# EAGLE schematic LED-plus-SHIM (EAGLE 9.6.2)

## Sheet 1 of 4
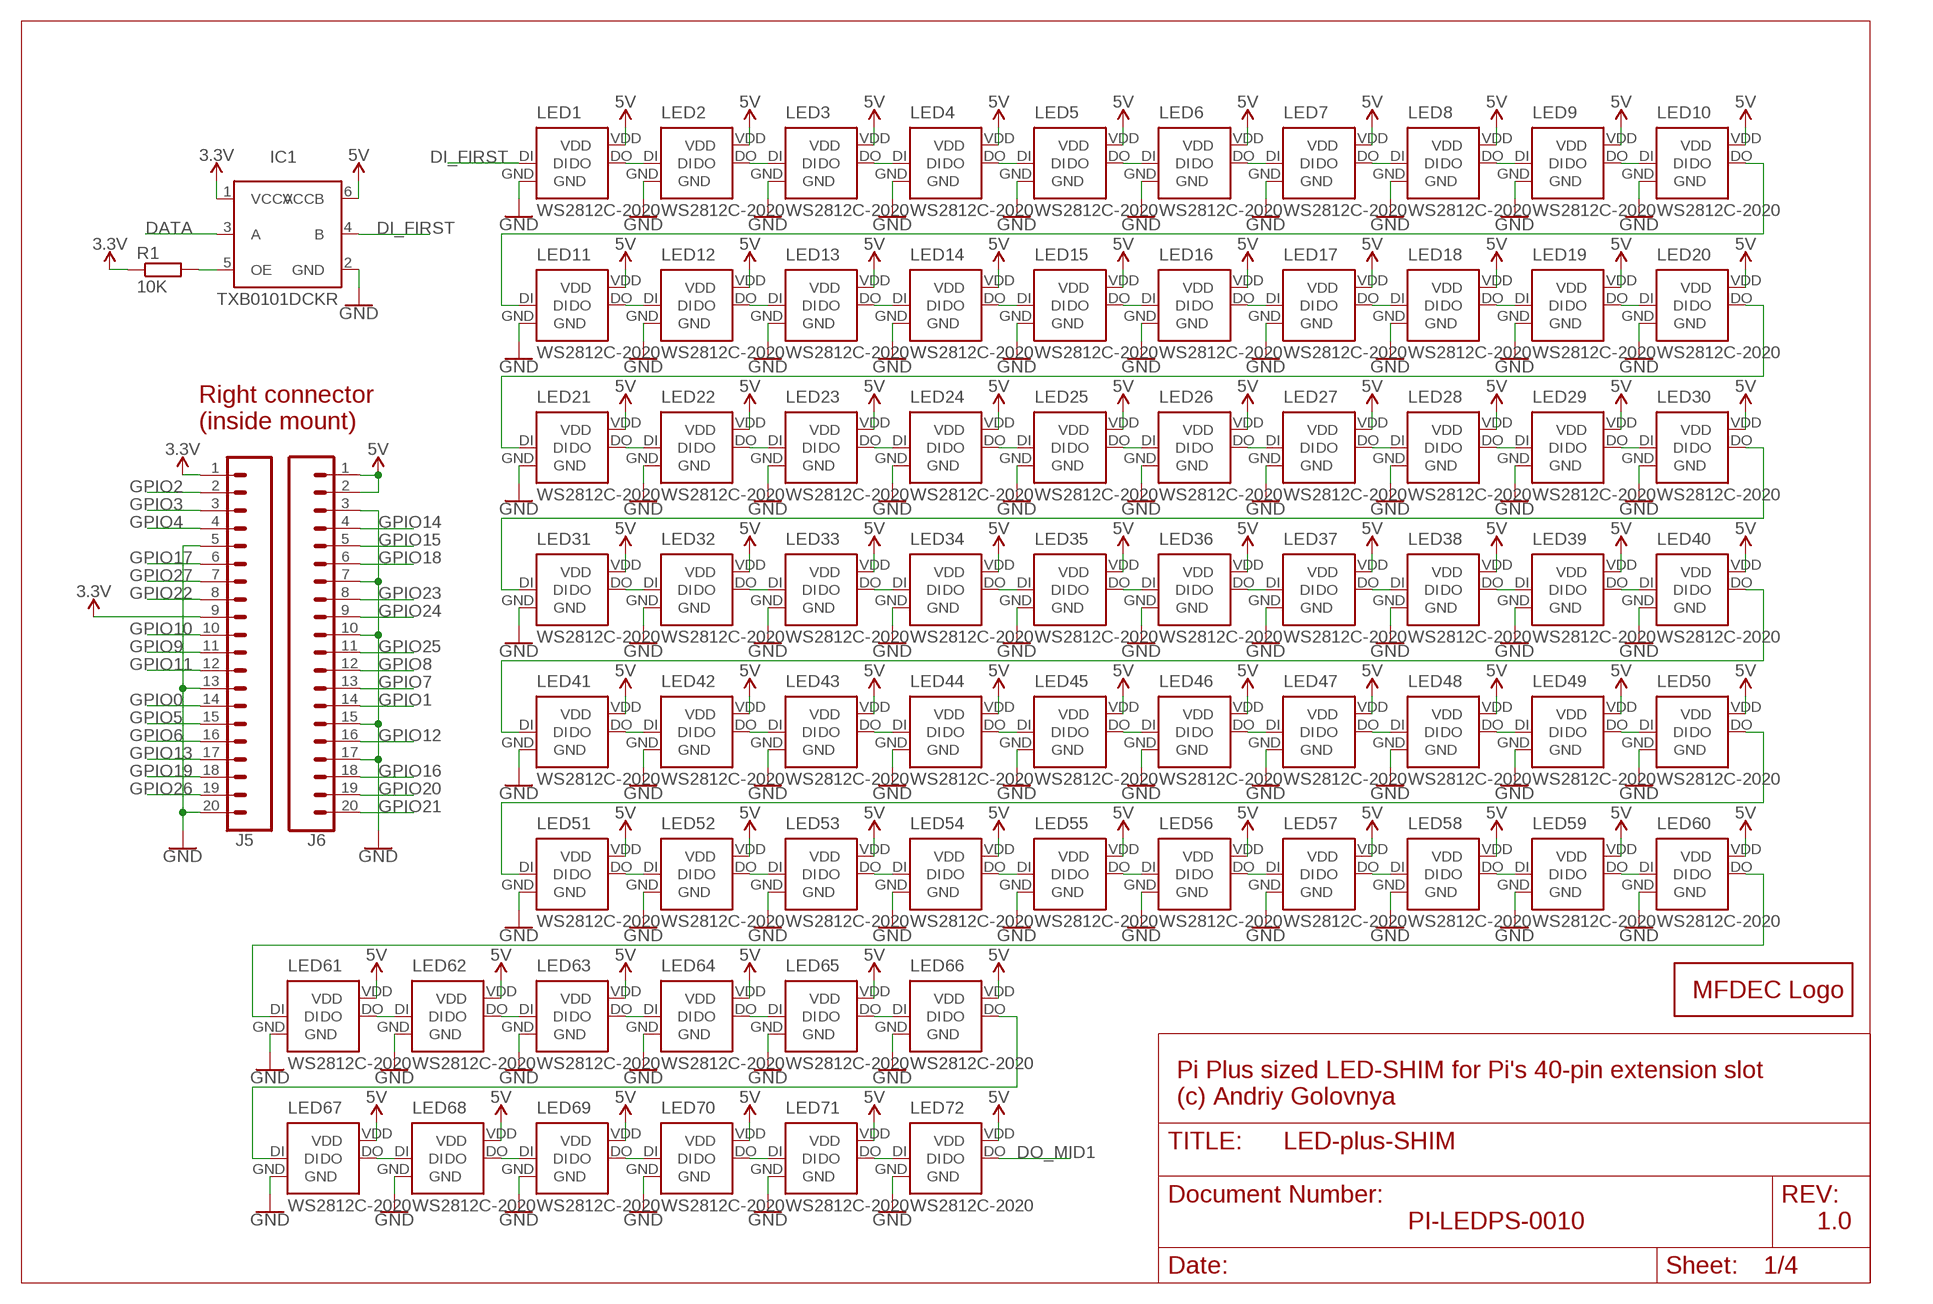
[diagram p0: schematic, sheet 1]

### Parts
IC1  TXB0101DCKR  [SOT65P210X110-6N]
J5  CONN_20LOCK  [1X20_LOCK]
J6  CONN_20LOCK  [1X20_LOCK]
LED1  WS2812C-2020  [WS2812X-2020]
LED2  WS2812C-2020  [WS2812X-2020]
LED3  WS2812C-2020  [WS2812X-2020]
LED4  WS2812C-2020  [WS2812X-2020]
LED5  WS2812C-2020  [WS2812X-2020]
LED6  WS2812C-2020  [WS2812X-2020]
LED7  WS2812C-2020  [WS2812X-2020]
LED8  WS2812C-2020  [WS2812X-2020]
LED9  WS2812C-2020  [WS2812X-2020]
LED10  WS2812C-2020  [WS2812X-2020]
LED11  WS2812C-2020  [WS2812X-2020]
LED12  WS2812C-2020  [WS2812X-2020]
LED13  WS2812C-2020  [WS2812X-2020]
LED14  WS2812C-2020  [WS2812X-2020]
LED15  WS2812C-2020  [WS2812X-2020]
LED16  WS2812C-2020  [WS2812X-2020]
LED17  WS2812C-2020  [WS2812X-2020]
LED18  WS2812C-2020  [WS2812X-2020]
LED19  WS2812C-2020  [WS2812X-2020]
LED20  WS2812C-2020  [WS2812X-2020]
LED21  WS2812C-2020  [WS2812X-2020]
LED22  WS2812C-2020  [WS2812X-2020]
LED23  WS2812C-2020  [WS2812X-2020]
LED24  WS2812C-2020  [WS2812X-2020]
LED25  WS2812C-2020  [WS2812X-2020]
LED26  WS2812C-2020  [WS2812X-2020]
LED27  WS2812C-2020  [WS2812X-2020]
LED28  WS2812C-2020  [WS2812X-2020]
LED29  WS2812C-2020  [WS2812X-2020]
LED30  WS2812C-2020  [WS2812X-2020]
LED31  WS2812C-2020  [WS2812X-2020]
LED32  WS2812C-2020  [WS2812X-2020]
LED33  WS2812C-2020  [WS2812X-2020]
LED34  WS2812C-2020  [WS2812X-2020]
LED35  WS2812C-2020  [WS2812X-2020]
LED36  WS2812C-2020  [WS2812X-2020]
LED37  WS2812C-2020  [WS2812X-2020]
LED38  WS2812C-2020  [WS2812X-2020]
LED39  WS2812C-2020  [WS2812X-2020]
LED40  WS2812C-2020  [WS2812X-2020]
LED41  WS2812C-2020  [WS2812X-2020]
LED42  WS2812C-2020  [WS2812X-2020]
LED43  WS2812C-2020  [WS2812X-2020]
LED44  WS2812C-2020  [WS2812X-2020]
LED45  WS2812C-2020  [WS2812X-2020]
LED46  WS2812C-2020  [WS2812X-2020]
LED47  WS2812C-2020  [WS2812X-2020]
LED48  WS2812C-2020  [WS2812X-2020]
LED49  WS2812C-2020  [WS2812X-2020]
LED50  WS2812C-2020  [WS2812X-2020]
LED51  WS2812C-2020  [WS2812X-2020]
LED52  WS2812C-2020  [WS2812X-2020]
LED53  WS2812C-2020  [WS2812X-2020]
LED54  WS2812C-2020  [WS2812X-2020]
LED55  WS2812C-2020  [WS2812X-2020]
LED56  WS2812C-2020  [WS2812X-2020]
LED57  WS2812C-2020  [WS2812X-2020]
LED58  WS2812C-2020  [WS2812X-2020]
LED59  WS2812C-2020  [WS2812X-2020]
LED60  WS2812C-2020  [WS2812X-2020]
LED61  WS2812C-2020  [WS2812X-2020]
LED62  WS2812C-2020  [WS2812X-2020]
LED63  WS2812C-2020  [WS2812X-2020]
LED64  WS2812C-2020  [WS2812X-2020]
LED65  WS2812C-2020  [WS2812X-2020]
LED66  WS2812C-2020  [WS2812X-2020]
LED67  WS2812C-2020  [WS2812X-2020]
LED68  WS2812C-2020  [WS2812X-2020]
LED69  WS2812C-2020  [WS2812X-2020]
LED70  WS2812C-2020  [WS2812X-2020]
LED71  WS2812C-2020  [WS2812X-2020]
LED72  WS2812C-2020  [WS2812X-2020]
LOGO1  MFDECLOGO_L_30MM  [MFDEC_L_30MM]
R1  10K  R-EU_R0402  [R0402]

### Nets
3.3V: IC1.1(VCCA) J5.1 J5.9 R1.1
5V: IC1.6(VCCB) J6.1 J6.2 LED1.VDD LED2.VDD LED3.VDD LED4.VDD LED5.VDD LED6.VDD LED7.VDD LED8.VDD LED9.VDD LED10.VDD LED11.VDD LED12.VDD LED13.VDD LED14.VDD LED15.VDD LED16.VDD LED17.VDD LED18.VDD LED19.VDD LED20.VDD LED21.VDD LED22.VDD LED23.VDD LED24.VDD LED25.VDD LED26.VDD LED27.VDD LED28.VDD LED29.VDD LED30.VDD LED31.VDD LED32.VDD LED33.VDD LED34.VDD LED35.VDD LED36.VDD LED37.VDD LED38.VDD LED39.VDD LED40.VDD LED41.VDD LED42.VDD LED43.VDD LED44.VDD LED45.VDD LED46.VDD LED47.VDD LED48.VDD LED49.VDD LED50.VDD LED51.VDD LED52.VDD LED53.VDD LED54.VDD LED55.VDD LED56.VDD LED57.VDD LED58.VDD LED59.VDD LED60.VDD LED61.VDD LED62.VDD LED63.VDD LED64.VDD LED65.VDD LED66.VDD LED67.VDD LED68.VDD LED69.VDD LED70.VDD LED71.VDD LED72.VDD ; also sheet 2,3,4
DATA: IC1.3(A) ; also sheet 2
DI_FIRST: IC1.4(B) LED1.DI ; also sheet 2
DO_MID1: LED72.DO ; also sheet 2
GND: IC1.2(GND) J5.5 J5.13 J5.20 J6.3 J6.7 J6.10 J6.15 J6.17 LED1.GND LED2.GND LED3.GND LED4.GND LED5.GND LED6.GND LED7.GND LED8.GND LED9.GND LED10.GND LED11.GND LED12.GND LED13.GND LED14.GND LED15.GND LED16.GND LED17.GND LED18.GND LED19.GND LED20.GND LED21.GND LED22.GND LED23.GND LED24.GND LED25.GND LED26.GND LED27.GND LED28.GND LED29.GND LED30.GND LED31.GND LED32.GND LED33.GND LED34.GND LED35.GND LED36.GND LED37.GND LED38.GND LED39.GND LED40.GND LED41.GND LED42.GND LED43.GND LED44.GND LED45.GND LED46.GND LED47.GND LED48.GND LED49.GND LED50.GND LED51.GND LED52.GND LED53.GND LED54.GND LED55.GND LED56.GND LED57.GND LED58.GND LED59.GND LED60.GND LED61.GND LED62.GND LED63.GND LED64.GND LED65.GND LED66.GND LED67.GND LED68.GND LED69.GND LED70.GND LED71.GND LED72.GND ; also sheet 2,3,4
GPIO0: J5.14
GPIO1: J6.14
GPIO2: J5.2
GPIO3: J5.3
GPIO4: J5.4
GPIO5: J5.15
GPIO6: J5.16
GPIO7: J6.13
GPIO8: J6.12
GPIO9: J5.11
GPIO10: J5.10 ; also sheet 2
GPIO11: J5.12
GPIO12: J6.16
GPIO13: J5.17
GPIO14: J6.4
GPIO15: J6.5
GPIO16: J6.18
GPIO17: J5.6
GPIO18: J6.6 ; also sheet 2
GPIO19: J5.18
GPIO20: J6.19
GPIO21: J6.20 ; also sheet 2
GPIO22: J5.8
GPIO23: J6.8
GPIO24: J6.9
GPIO25: J6.11
GPIO26: J5.19
GPIO27: J5.7
N$1: LED1.DO LED2.DI
N$2: LED2.DO LED3.DI
N$3: LED3.DO LED4.DI
N$4: LED4.DO LED5.DI
N$5: LED5.DO LED6.DI
N$6: LED6.DO LED7.DI
N$7: LED7.DO LED8.DI
N$8: LED8.DO LED9.DI
N$9: LED9.DO LED10.DI
N$10: LED10.DO LED11.DI
N$11: LED11.DO LED12.DI
N$12: LED12.DO LED13.DI
N$13: LED13.DO LED14.DI
N$14: LED14.DO LED15.DI
N$15: LED15.DO LED16.DI
N$16: LED16.DO LED17.DI
N$17: LED17.DO LED18.DI
N$18: LED18.DO LED19.DI
N$19: LED19.DO LED20.DI
N$20: LED20.DO LED21.DI
N$21: LED21.DO LED22.DI
N$22: LED22.DO LED23.DI
N$23: LED23.DO LED24.DI
N$24: LED24.DO LED25.DI
N$25: LED25.DO LED26.DI
N$26: LED26.DO LED27.DI
N$27: LED27.DO LED28.DI
N$28: LED28.DO LED29.DI
N$29: LED29.DO LED30.DI
N$30: LED30.DO LED31.DI
N$31: LED31.DO LED32.DI
N$32: LED32.DO LED33.DI
N$33: LED33.DO LED34.DI
N$34: LED34.DO LED35.DI
N$35: LED35.DO LED36.DI
N$36: LED36.DO LED37.DI
N$37: LED37.DO LED38.DI
N$38: LED38.DO LED39.DI
N$39: LED39.DO LED40.DI
N$40: LED40.DO LED41.DI
N$41: LED41.DO LED42.DI
N$42: LED42.DO LED43.DI
N$43: LED43.DO LED44.DI
N$44: LED44.DO LED45.DI
N$45: LED45.DO LED46.DI
N$46: LED46.DO LED47.DI
N$47: LED47.DO LED48.DI
N$48: LED48.DO LED49.DI
N$49: LED49.DO LED50.DI
N$50: LED50.DO LED51.DI
N$51: LED51.DO LED52.DI
N$52: LED52.DO LED53.DI
N$53: LED53.DO LED54.DI
N$54: LED54.DO LED55.DI
N$55: LED55.DO LED56.DI
N$56: LED56.DO LED57.DI
N$57: LED57.DO LED58.DI
N$58: LED58.DO LED59.DI
N$59: LED59.DO LED60.DI
N$60: LED60.DO LED61.DI
N$61: LED61.DO LED62.DI
N$62: LED62.DO LED63.DI
N$63: LED63.DO LED64.DI
N$64: LED64.DO LED65.DI
N$65: LED65.DO LED66.DI
N$66: LED66.DO LED67.DI
N$67: LED67.DO LED68.DI
N$68: LED68.DO LED69.DI
N$69: LED69.DO LED70.DI
N$70: LED70.DO LED71.DI
N$71: LED71.DO LED72.DI
N$143: IC1.5(OE) R1.2

### Notes on the sheet
- Right connector
  (inside mount)
- Pi Plus sized LED-SHIM for Pi's 40-pin extension slot
  (c) Andriy Golovnya
- PI-LEDPS-0010 | 1.0

## Sheet 2 of 4
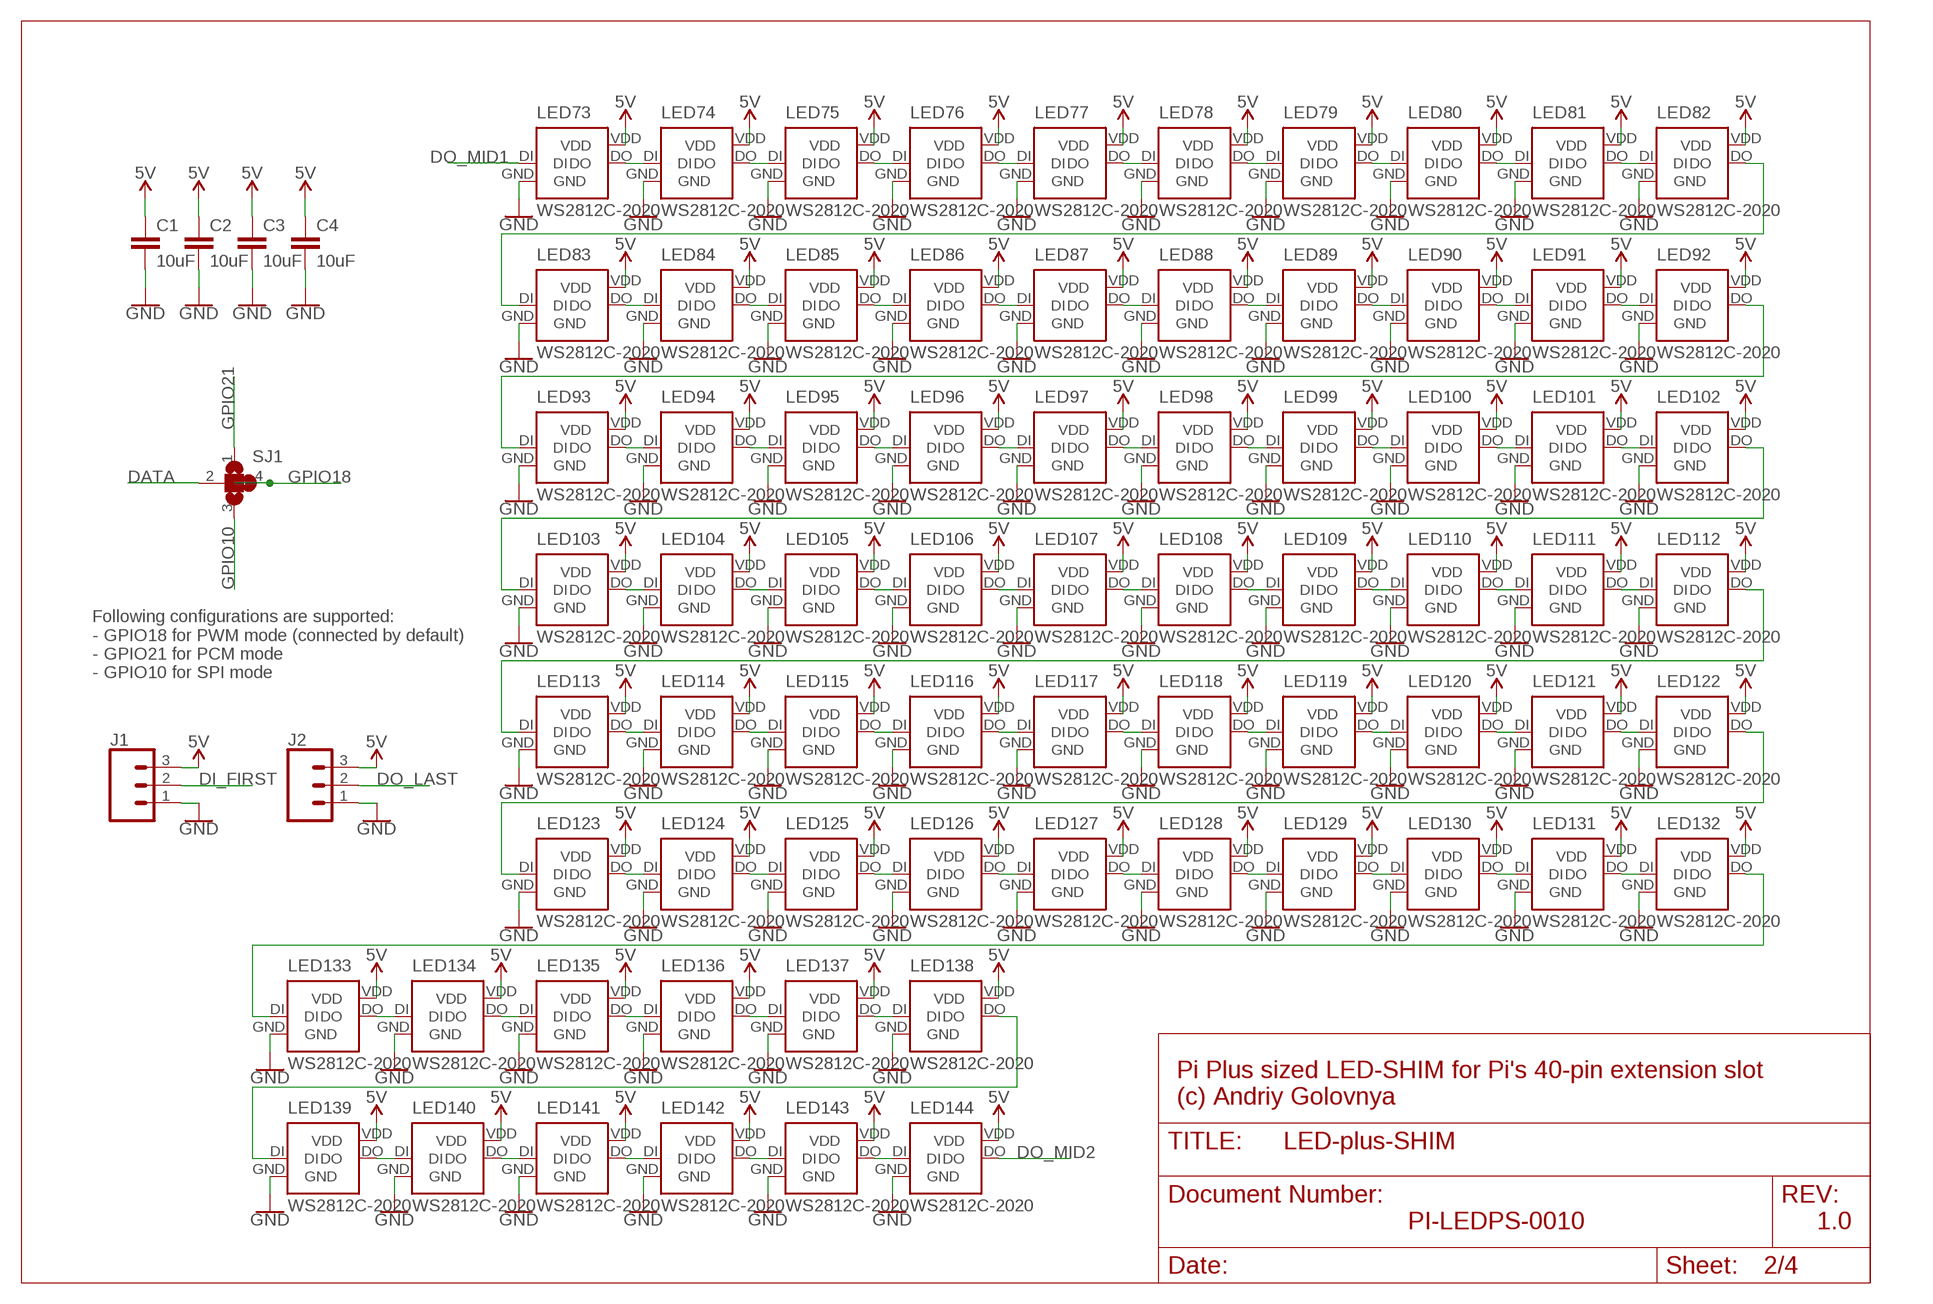
[diagram p1: schematic, sheet 2]

### Parts
C1  10uF  C-EUC0805  [C0805]
C2  10uF  C-EUC0805  [C0805]
C3  10uF  C-EUC0805  [C0805]
C4  10uF  C-EUC0805  [C0805]
J1  CONN_03  [1X03]
J2  CONN_03  [1X03]
LED73  WS2812C-2020  [WS2812X-2020]
LED74  WS2812C-2020  [WS2812X-2020]
LED75  WS2812C-2020  [WS2812X-2020]
LED76  WS2812C-2020  [WS2812X-2020]
LED77  WS2812C-2020  [WS2812X-2020]
LED78  WS2812C-2020  [WS2812X-2020]
LED79  WS2812C-2020  [WS2812X-2020]
LED80  WS2812C-2020  [WS2812X-2020]
LED81  WS2812C-2020  [WS2812X-2020]
LED82  WS2812C-2020  [WS2812X-2020]
LED83  WS2812C-2020  [WS2812X-2020]
LED84  WS2812C-2020  [WS2812X-2020]
LED85  WS2812C-2020  [WS2812X-2020]
LED86  WS2812C-2020  [WS2812X-2020]
LED87  WS2812C-2020  [WS2812X-2020]
LED88  WS2812C-2020  [WS2812X-2020]
LED89  WS2812C-2020  [WS2812X-2020]
LED90  WS2812C-2020  [WS2812X-2020]
LED91  WS2812C-2020  [WS2812X-2020]
LED92  WS2812C-2020  [WS2812X-2020]
LED93  WS2812C-2020  [WS2812X-2020]
LED94  WS2812C-2020  [WS2812X-2020]
LED95  WS2812C-2020  [WS2812X-2020]
LED96  WS2812C-2020  [WS2812X-2020]
LED97  WS2812C-2020  [WS2812X-2020]
LED98  WS2812C-2020  [WS2812X-2020]
LED99  WS2812C-2020  [WS2812X-2020]
LED100  WS2812C-2020  [WS2812X-2020]
LED101  WS2812C-2020  [WS2812X-2020]
LED102  WS2812C-2020  [WS2812X-2020]
LED103  WS2812C-2020  [WS2812X-2020]
LED104  WS2812C-2020  [WS2812X-2020]
LED105  WS2812C-2020  [WS2812X-2020]
LED106  WS2812C-2020  [WS2812X-2020]
LED107  WS2812C-2020  [WS2812X-2020]
LED108  WS2812C-2020  [WS2812X-2020]
LED109  WS2812C-2020  [WS2812X-2020]
LED110  WS2812C-2020  [WS2812X-2020]
LED111  WS2812C-2020  [WS2812X-2020]
LED112  WS2812C-2020  [WS2812X-2020]
LED113  WS2812C-2020  [WS2812X-2020]
LED114  WS2812C-2020  [WS2812X-2020]
LED115  WS2812C-2020  [WS2812X-2020]
LED116  WS2812C-2020  [WS2812X-2020]
LED117  WS2812C-2020  [WS2812X-2020]
LED118  WS2812C-2020  [WS2812X-2020]
LED119  WS2812C-2020  [WS2812X-2020]
LED120  WS2812C-2020  [WS2812X-2020]
LED121  WS2812C-2020  [WS2812X-2020]
LED122  WS2812C-2020  [WS2812X-2020]
LED123  WS2812C-2020  [WS2812X-2020]
LED124  WS2812C-2020  [WS2812X-2020]
LED125  WS2812C-2020  [WS2812X-2020]
LED126  WS2812C-2020  [WS2812X-2020]
LED127  WS2812C-2020  [WS2812X-2020]
LED128  WS2812C-2020  [WS2812X-2020]
LED129  WS2812C-2020  [WS2812X-2020]
LED130  WS2812C-2020  [WS2812X-2020]
LED131  WS2812C-2020  [WS2812X-2020]
LED132  WS2812C-2020  [WS2812X-2020]
LED133  WS2812C-2020  [WS2812X-2020]
LED134  WS2812C-2020  [WS2812X-2020]
LED135  WS2812C-2020  [WS2812X-2020]
LED136  WS2812C-2020  [WS2812X-2020]
LED137  WS2812C-2020  [WS2812X-2020]
LED138  WS2812C-2020  [WS2812X-2020]
LED139  WS2812C-2020  [WS2812X-2020]
LED140  WS2812C-2020  [WS2812X-2020]
LED141  WS2812C-2020  [WS2812X-2020]
LED142  WS2812C-2020  [WS2812X-2020]
LED143  WS2812C-2020  [WS2812X-2020]
LED144  WS2812C-2020  [WS2812X-2020]
SJ1  SJ3  [SJ_3]

### Nets
5V: C1.1 C2.1 C3.1 C4.1 J1.3 J2.3 LED73.VDD LED74.VDD LED75.VDD LED76.VDD LED77.VDD LED78.VDD LED79.VDD LED80.VDD LED81.VDD LED82.VDD LED83.VDD LED84.VDD LED85.VDD LED86.VDD LED87.VDD LED88.VDD LED89.VDD LED90.VDD LED91.VDD LED92.VDD LED93.VDD LED94.VDD LED95.VDD LED96.VDD LED97.VDD LED98.VDD LED99.VDD LED100.VDD LED101.VDD LED102.VDD LED103.VDD LED104.VDD LED105.VDD LED106.VDD LED107.VDD LED108.VDD LED109.VDD LED110.VDD LED111.VDD LED112.VDD LED113.VDD LED114.VDD LED115.VDD LED116.VDD LED117.VDD LED118.VDD LED119.VDD LED120.VDD LED121.VDD LED122.VDD LED123.VDD LED124.VDD LED125.VDD LED126.VDD LED127.VDD LED128.VDD LED129.VDD LED130.VDD LED131.VDD LED132.VDD LED133.VDD LED134.VDD LED135.VDD LED136.VDD LED137.VDD LED138.VDD LED139.VDD LED140.VDD LED141.VDD LED142.VDD LED143.VDD LED144.VDD ; also sheet 1,3,4
DATA: SJ1.2 ; also sheet 1
DI_FIRST: J1.2 ; also sheet 1
DO_LAST: J2.2 ; also sheet 4
DO_MID1: LED73.DI ; also sheet 1
DO_MID2: LED144.DO ; also sheet 3
GND: C1.2 C2.2 C3.2 C4.2 J1.1 J2.1 LED73.GND LED74.GND LED75.GND LED76.GND LED77.GND LED78.GND LED79.GND LED80.GND LED81.GND LED82.GND LED83.GND LED84.GND LED85.GND LED86.GND LED87.GND LED88.GND LED89.GND LED90.GND LED91.GND LED92.GND LED93.GND LED94.GND LED95.GND LED96.GND LED97.GND LED98.GND LED99.GND LED100.GND LED101.GND LED102.GND LED103.GND LED104.GND LED105.GND LED106.GND LED107.GND LED108.GND LED109.GND LED110.GND LED111.GND LED112.GND LED113.GND LED114.GND LED115.GND LED116.GND LED117.GND LED118.GND LED119.GND LED120.GND LED121.GND LED122.GND LED123.GND LED124.GND LED125.GND LED126.GND LED127.GND LED128.GND LED129.GND LED130.GND LED131.GND LED132.GND LED133.GND LED134.GND LED135.GND LED136.GND LED137.GND LED138.GND LED139.GND LED140.GND LED141.GND LED142.GND LED143.GND LED144.GND ; also sheet 1,3,4
GPIO10: SJ1.3 ; also sheet 1
GPIO18: SJ1.4 ; also sheet 1
GPIO21: SJ1.1 ; also sheet 1
N$72: LED73.DO LED74.DI
N$73: LED74.DO LED75.DI
N$74: LED75.DO LED76.DI
N$75: LED76.DO LED77.DI
N$76: LED77.DO LED78.DI
N$77: LED78.DO LED79.DI
N$78: LED79.DO LED80.DI
N$79: LED80.DO LED81.DI
N$80: LED81.DO LED82.DI
N$81: LED82.DO LED83.DI
N$82: LED83.DO LED84.DI
N$83: LED84.DO LED85.DI
N$84: LED85.DO LED86.DI
N$85: LED86.DO LED87.DI
N$86: LED87.DO LED88.DI
N$87: LED88.DO LED89.DI
N$88: LED89.DO LED90.DI
N$89: LED90.DO LED91.DI
N$90: LED91.DO LED92.DI
N$91: LED92.DO LED93.DI
N$92: LED93.DO LED94.DI
N$93: LED94.DO LED95.DI
N$94: LED95.DO LED96.DI
N$95: LED96.DO LED97.DI
N$96: LED97.DO LED98.DI
N$97: LED98.DO LED99.DI
N$98: LED99.DO LED100.DI
N$99: LED100.DO LED101.DI
N$100: LED101.DO LED102.DI
N$101: LED102.DO LED103.DI
N$102: LED103.DO LED104.DI
N$103: LED104.DO LED105.DI
N$104: LED105.DO LED106.DI
N$105: LED106.DO LED107.DI
N$106: LED107.DO LED108.DI
N$107: LED108.DO LED109.DI
N$108: LED109.DO LED110.DI
N$109: LED110.DO LED111.DI
N$110: LED111.DO LED112.DI
N$111: LED112.DO LED113.DI
N$112: LED113.DO LED114.DI
N$113: LED114.DO LED115.DI
N$114: LED115.DO LED116.DI
N$115: LED116.DO LED117.DI
N$116: LED117.DO LED118.DI
N$117: LED118.DO LED119.DI
N$118: LED119.DO LED120.DI
N$119: LED120.DO LED121.DI
N$120: LED121.DO LED122.DI
N$121: LED122.DO LED123.DI
N$122: LED123.DO LED124.DI
N$123: LED124.DO LED125.DI
N$124: LED125.DO LED126.DI
N$125: LED126.DO LED127.DI
N$126: LED127.DO LED128.DI
N$127: LED128.DO LED129.DI
N$128: LED129.DO LED130.DI
N$129: LED130.DO LED131.DI
N$130: LED131.DO LED132.DI
N$131: LED132.DO LED133.DI
N$132: LED133.DO LED134.DI
N$133: LED134.DO LED135.DI
N$134: LED135.DO LED136.DI
N$135: LED136.DO LED137.DI
N$136: LED137.DO LED138.DI
N$137: LED138.DO LED139.DI
N$138: LED139.DO LED140.DI
N$139: LED140.DO LED141.DI
N$140: LED141.DO LED142.DI
N$141: LED142.DO LED143.DI
N$142: LED143.DO LED144.DI

### Notes on the sheet
- Following configurations are supported:
  - GPIO18 for PWM mode (connected by default)
  - GPIO21 for PCM mode
  - GPIO10 for SPI mode
- Pi Plus sized LED-SHIM for Pi's 40-pin extension slot
  (c) Andriy Golovnya
- PI-LEDPS-0010 | 1.0

## Sheet 3 of 4
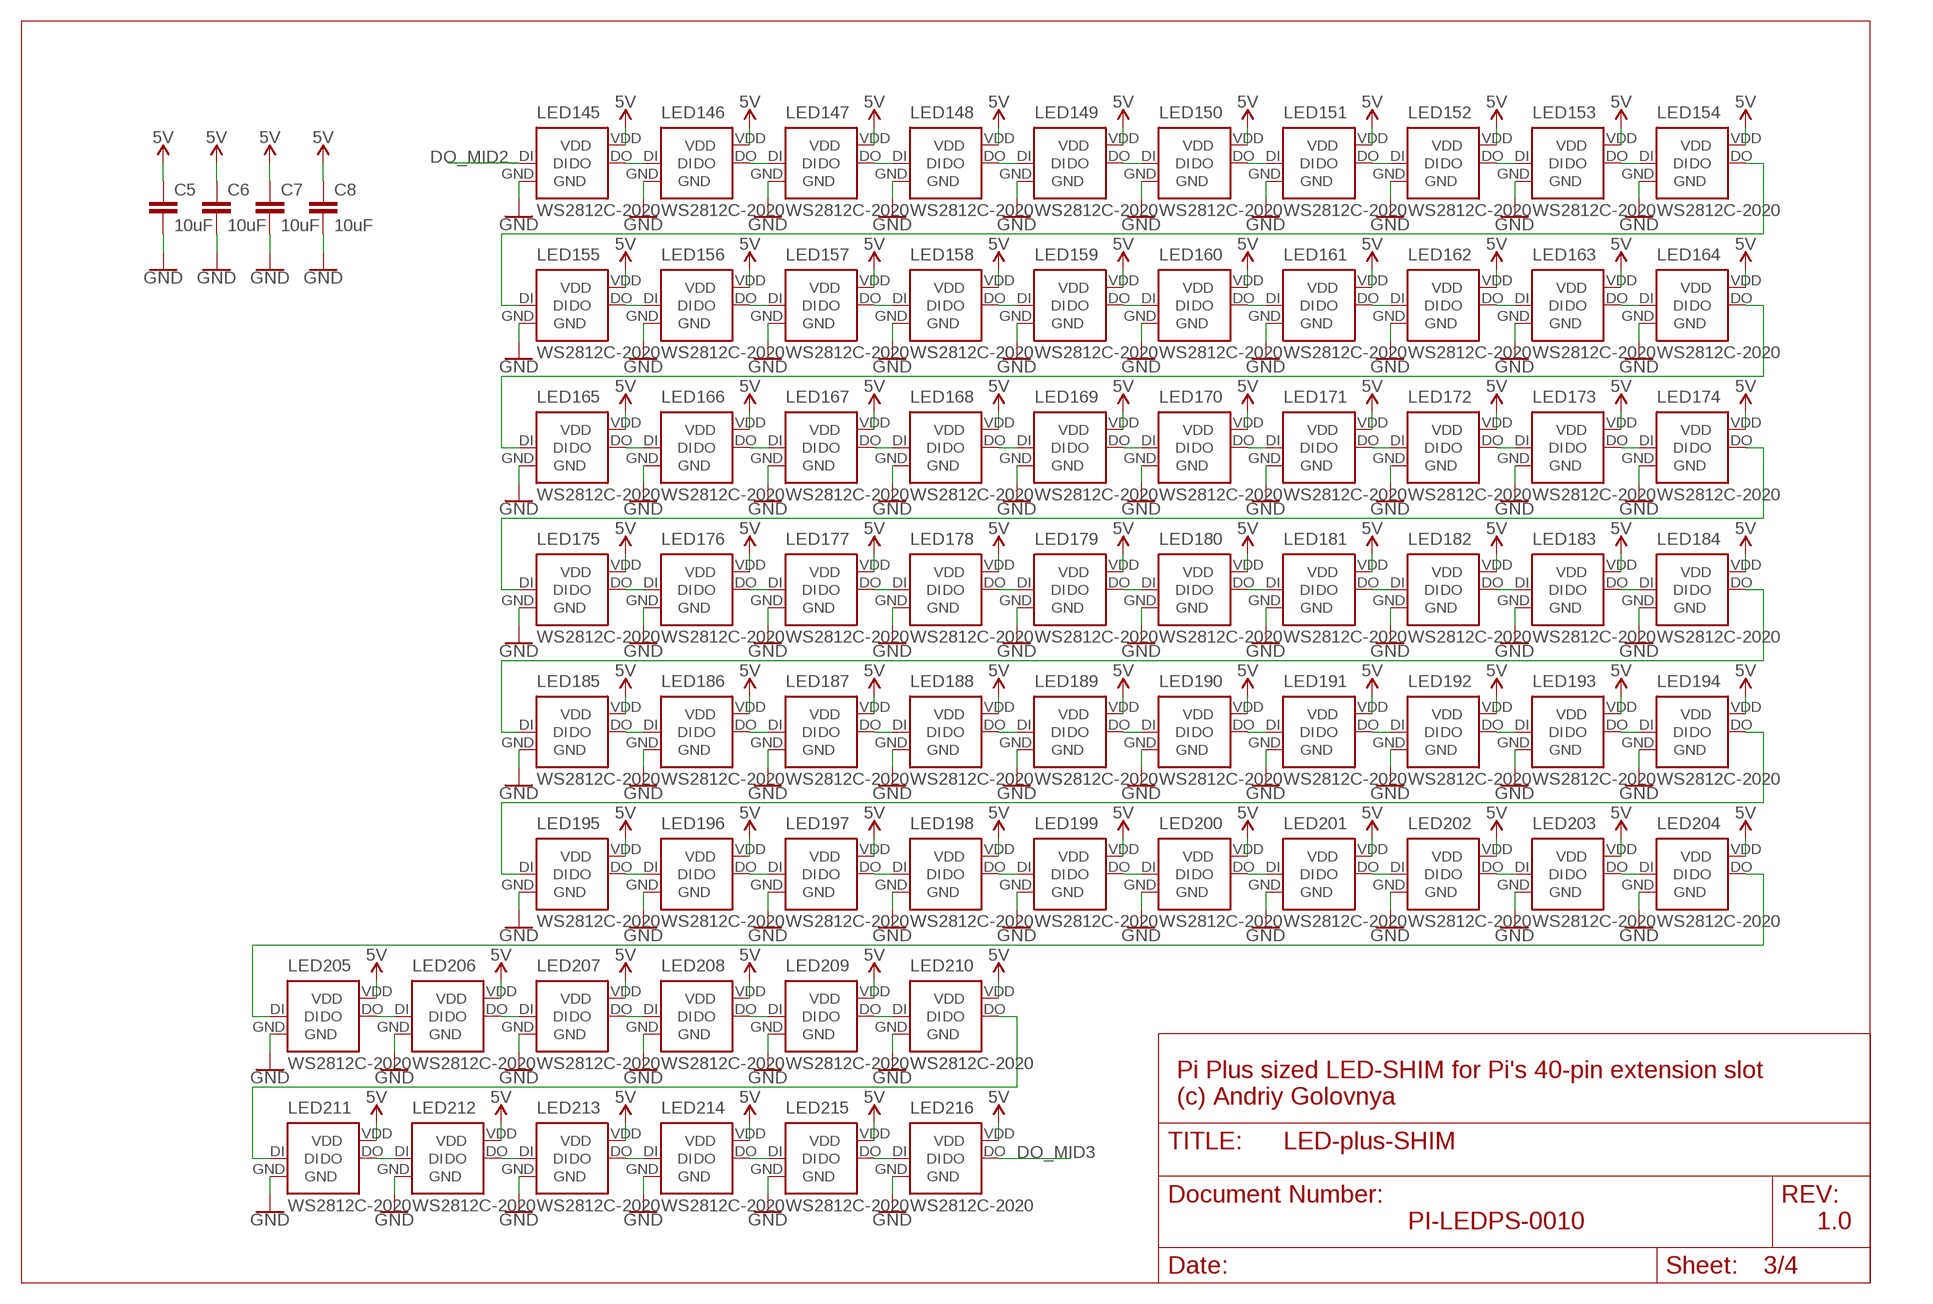
[diagram p2: schematic, sheet 3]

### Parts
C5  10uF  C-EUC0805  [C0805]
C6  10uF  C-EUC0805  [C0805]
C7  10uF  C-EUC0805  [C0805]
C8  10uF  C-EUC0805  [C0805]
LED145  WS2812C-2020  [WS2812X-2020]
LED146  WS2812C-2020  [WS2812X-2020]
LED147  WS2812C-2020  [WS2812X-2020]
LED148  WS2812C-2020  [WS2812X-2020]
LED149  WS2812C-2020  [WS2812X-2020]
LED150  WS2812C-2020  [WS2812X-2020]
LED151  WS2812C-2020  [WS2812X-2020]
LED152  WS2812C-2020  [WS2812X-2020]
LED153  WS2812C-2020  [WS2812X-2020]
LED154  WS2812C-2020  [WS2812X-2020]
LED155  WS2812C-2020  [WS2812X-2020]
LED156  WS2812C-2020  [WS2812X-2020]
LED157  WS2812C-2020  [WS2812X-2020]
LED158  WS2812C-2020  [WS2812X-2020]
LED159  WS2812C-2020  [WS2812X-2020]
LED160  WS2812C-2020  [WS2812X-2020]
LED161  WS2812C-2020  [WS2812X-2020]
LED162  WS2812C-2020  [WS2812X-2020]
LED163  WS2812C-2020  [WS2812X-2020]
LED164  WS2812C-2020  [WS2812X-2020]
LED165  WS2812C-2020  [WS2812X-2020]
LED166  WS2812C-2020  [WS2812X-2020]
LED167  WS2812C-2020  [WS2812X-2020]
LED168  WS2812C-2020  [WS2812X-2020]
LED169  WS2812C-2020  [WS2812X-2020]
LED170  WS2812C-2020  [WS2812X-2020]
LED171  WS2812C-2020  [WS2812X-2020]
LED172  WS2812C-2020  [WS2812X-2020]
LED173  WS2812C-2020  [WS2812X-2020]
LED174  WS2812C-2020  [WS2812X-2020]
LED175  WS2812C-2020  [WS2812X-2020]
LED176  WS2812C-2020  [WS2812X-2020]
LED177  WS2812C-2020  [WS2812X-2020]
LED178  WS2812C-2020  [WS2812X-2020]
LED179  WS2812C-2020  [WS2812X-2020]
LED180  WS2812C-2020  [WS2812X-2020]
LED181  WS2812C-2020  [WS2812X-2020]
LED182  WS2812C-2020  [WS2812X-2020]
LED183  WS2812C-2020  [WS2812X-2020]
LED184  WS2812C-2020  [WS2812X-2020]
LED185  WS2812C-2020  [WS2812X-2020]
LED186  WS2812C-2020  [WS2812X-2020]
LED187  WS2812C-2020  [WS2812X-2020]
LED188  WS2812C-2020  [WS2812X-2020]
LED189  WS2812C-2020  [WS2812X-2020]
LED190  WS2812C-2020  [WS2812X-2020]
LED191  WS2812C-2020  [WS2812X-2020]
LED192  WS2812C-2020  [WS2812X-2020]
LED193  WS2812C-2020  [WS2812X-2020]
LED194  WS2812C-2020  [WS2812X-2020]
LED195  WS2812C-2020  [WS2812X-2020]
LED196  WS2812C-2020  [WS2812X-2020]
LED197  WS2812C-2020  [WS2812X-2020]
LED198  WS2812C-2020  [WS2812X-2020]
LED199  WS2812C-2020  [WS2812X-2020]
LED200  WS2812C-2020  [WS2812X-2020]
LED201  WS2812C-2020  [WS2812X-2020]
LED202  WS2812C-2020  [WS2812X-2020]
LED203  WS2812C-2020  [WS2812X-2020]
LED204  WS2812C-2020  [WS2812X-2020]
LED205  WS2812C-2020  [WS2812X-2020]
LED206  WS2812C-2020  [WS2812X-2020]
LED207  WS2812C-2020  [WS2812X-2020]
LED208  WS2812C-2020  [WS2812X-2020]
LED209  WS2812C-2020  [WS2812X-2020]
LED210  WS2812C-2020  [WS2812X-2020]
LED211  WS2812C-2020  [WS2812X-2020]
LED212  WS2812C-2020  [WS2812X-2020]
LED213  WS2812C-2020  [WS2812X-2020]
LED214  WS2812C-2020  [WS2812X-2020]
LED215  WS2812C-2020  [WS2812X-2020]
LED216  WS2812C-2020  [WS2812X-2020]

### Nets
5V: C5.1 C6.1 C7.1 C8.1 LED145.VDD LED146.VDD LED147.VDD LED148.VDD LED149.VDD LED150.VDD LED151.VDD LED152.VDD LED153.VDD LED154.VDD LED155.VDD LED156.VDD LED157.VDD LED158.VDD LED159.VDD LED160.VDD LED161.VDD LED162.VDD LED163.VDD LED164.VDD LED165.VDD LED166.VDD LED167.VDD LED168.VDD LED169.VDD LED170.VDD LED171.VDD LED172.VDD LED173.VDD LED174.VDD LED175.VDD LED176.VDD LED177.VDD LED178.VDD LED179.VDD LED180.VDD LED181.VDD LED182.VDD LED183.VDD LED184.VDD LED185.VDD LED186.VDD LED187.VDD LED188.VDD LED189.VDD LED190.VDD LED191.VDD LED192.VDD LED193.VDD LED194.VDD LED195.VDD LED196.VDD LED197.VDD LED198.VDD LED199.VDD LED200.VDD LED201.VDD LED202.VDD LED203.VDD LED204.VDD LED205.VDD LED206.VDD LED207.VDD LED208.VDD LED209.VDD LED210.VDD LED211.VDD LED212.VDD LED213.VDD LED214.VDD LED215.VDD LED216.VDD ; also sheet 1,2,4
DO_MID2: LED145.DI ; also sheet 2
DO_MID3: LED216.DO ; also sheet 4
GND: C5.2 C6.2 C7.2 C8.2 LED145.GND LED146.GND LED147.GND LED148.GND LED149.GND LED150.GND LED151.GND LED152.GND LED153.GND LED154.GND LED155.GND LED156.GND LED157.GND LED158.GND LED159.GND LED160.GND LED161.GND LED162.GND LED163.GND LED164.GND LED165.GND LED166.GND LED167.GND LED168.GND LED169.GND LED170.GND LED171.GND LED172.GND LED173.GND LED174.GND LED175.GND LED176.GND LED177.GND LED178.GND LED179.GND LED180.GND LED181.GND LED182.GND LED183.GND LED184.GND LED185.GND LED186.GND LED187.GND LED188.GND LED189.GND LED190.GND LED191.GND LED192.GND LED193.GND LED194.GND LED195.GND LED196.GND LED197.GND LED198.GND LED199.GND LED200.GND LED201.GND LED202.GND LED203.GND LED204.GND LED205.GND LED206.GND LED207.GND LED208.GND LED209.GND LED210.GND LED211.GND LED212.GND LED213.GND LED214.GND LED215.GND LED216.GND ; also sheet 1,2,4
N$144: LED145.DO LED146.DI
N$145: LED146.DO LED147.DI
N$146: LED147.DO LED148.DI
N$147: LED148.DO LED149.DI
N$148: LED149.DO LED150.DI
N$149: LED150.DO LED151.DI
N$150: LED151.DO LED152.DI
N$151: LED152.DO LED153.DI
N$152: LED153.DO LED154.DI
N$153: LED154.DO LED155.DI
N$154: LED155.DO LED156.DI
N$155: LED156.DO LED157.DI
N$156: LED157.DO LED158.DI
N$157: LED158.DO LED159.DI
N$158: LED159.DO LED160.DI
N$159: LED160.DO LED161.DI
N$160: LED161.DO LED162.DI
N$161: LED162.DO LED163.DI
N$162: LED163.DO LED164.DI
N$163: LED164.DO LED165.DI
N$164: LED165.DO LED166.DI
N$165: LED166.DO LED167.DI
N$166: LED167.DO LED168.DI
N$167: LED168.DO LED169.DI
N$168: LED169.DO LED170.DI
N$169: LED170.DO LED171.DI
N$170: LED171.DO LED172.DI
N$171: LED172.DO LED173.DI
N$172: LED173.DO LED174.DI
N$173: LED174.DO LED175.DI
N$174: LED175.DO LED176.DI
N$175: LED176.DO LED177.DI
N$176: LED177.DO LED178.DI
N$177: LED178.DO LED179.DI
N$178: LED179.DO LED180.DI
N$179: LED180.DO LED181.DI
N$180: LED181.DO LED182.DI
N$181: LED182.DO LED183.DI
N$182: LED183.DO LED184.DI
N$183: LED184.DO LED185.DI
N$184: LED185.DO LED186.DI
N$185: LED186.DO LED187.DI
N$186: LED187.DO LED188.DI
N$187: LED188.DO LED189.DI
N$188: LED189.DO LED190.DI
N$189: LED190.DO LED191.DI
N$190: LED191.DO LED192.DI
N$191: LED192.DO LED193.DI
N$192: LED193.DO LED194.DI
N$193: LED194.DO LED195.DI
N$194: LED195.DO LED196.DI
N$195: LED196.DO LED197.DI
N$196: LED197.DO LED198.DI
N$197: LED198.DO LED199.DI
N$198: LED199.DO LED200.DI
N$199: LED200.DO LED201.DI
N$200: LED201.DO LED202.DI
N$201: LED202.DO LED203.DI
N$202: LED203.DO LED204.DI
N$203: LED204.DO LED205.DI
N$204: LED205.DO LED206.DI
N$205: LED206.DO LED207.DI
N$206: LED207.DO LED208.DI
N$207: LED208.DO LED209.DI
N$208: LED209.DO LED210.DI
N$209: LED210.DO LED211.DI
N$210: LED211.DO LED212.DI
N$211: LED212.DO LED213.DI
N$212: LED213.DO LED214.DI
N$213: LED214.DO LED215.DI
N$214: LED215.DO LED216.DI

### Notes on the sheet
- Pi Plus sized LED-SHIM for Pi's 40-pin extension slot
  (c) Andriy Golovnya
- PI-LEDPS-0010 | 1.0

## Sheet 4 of 4
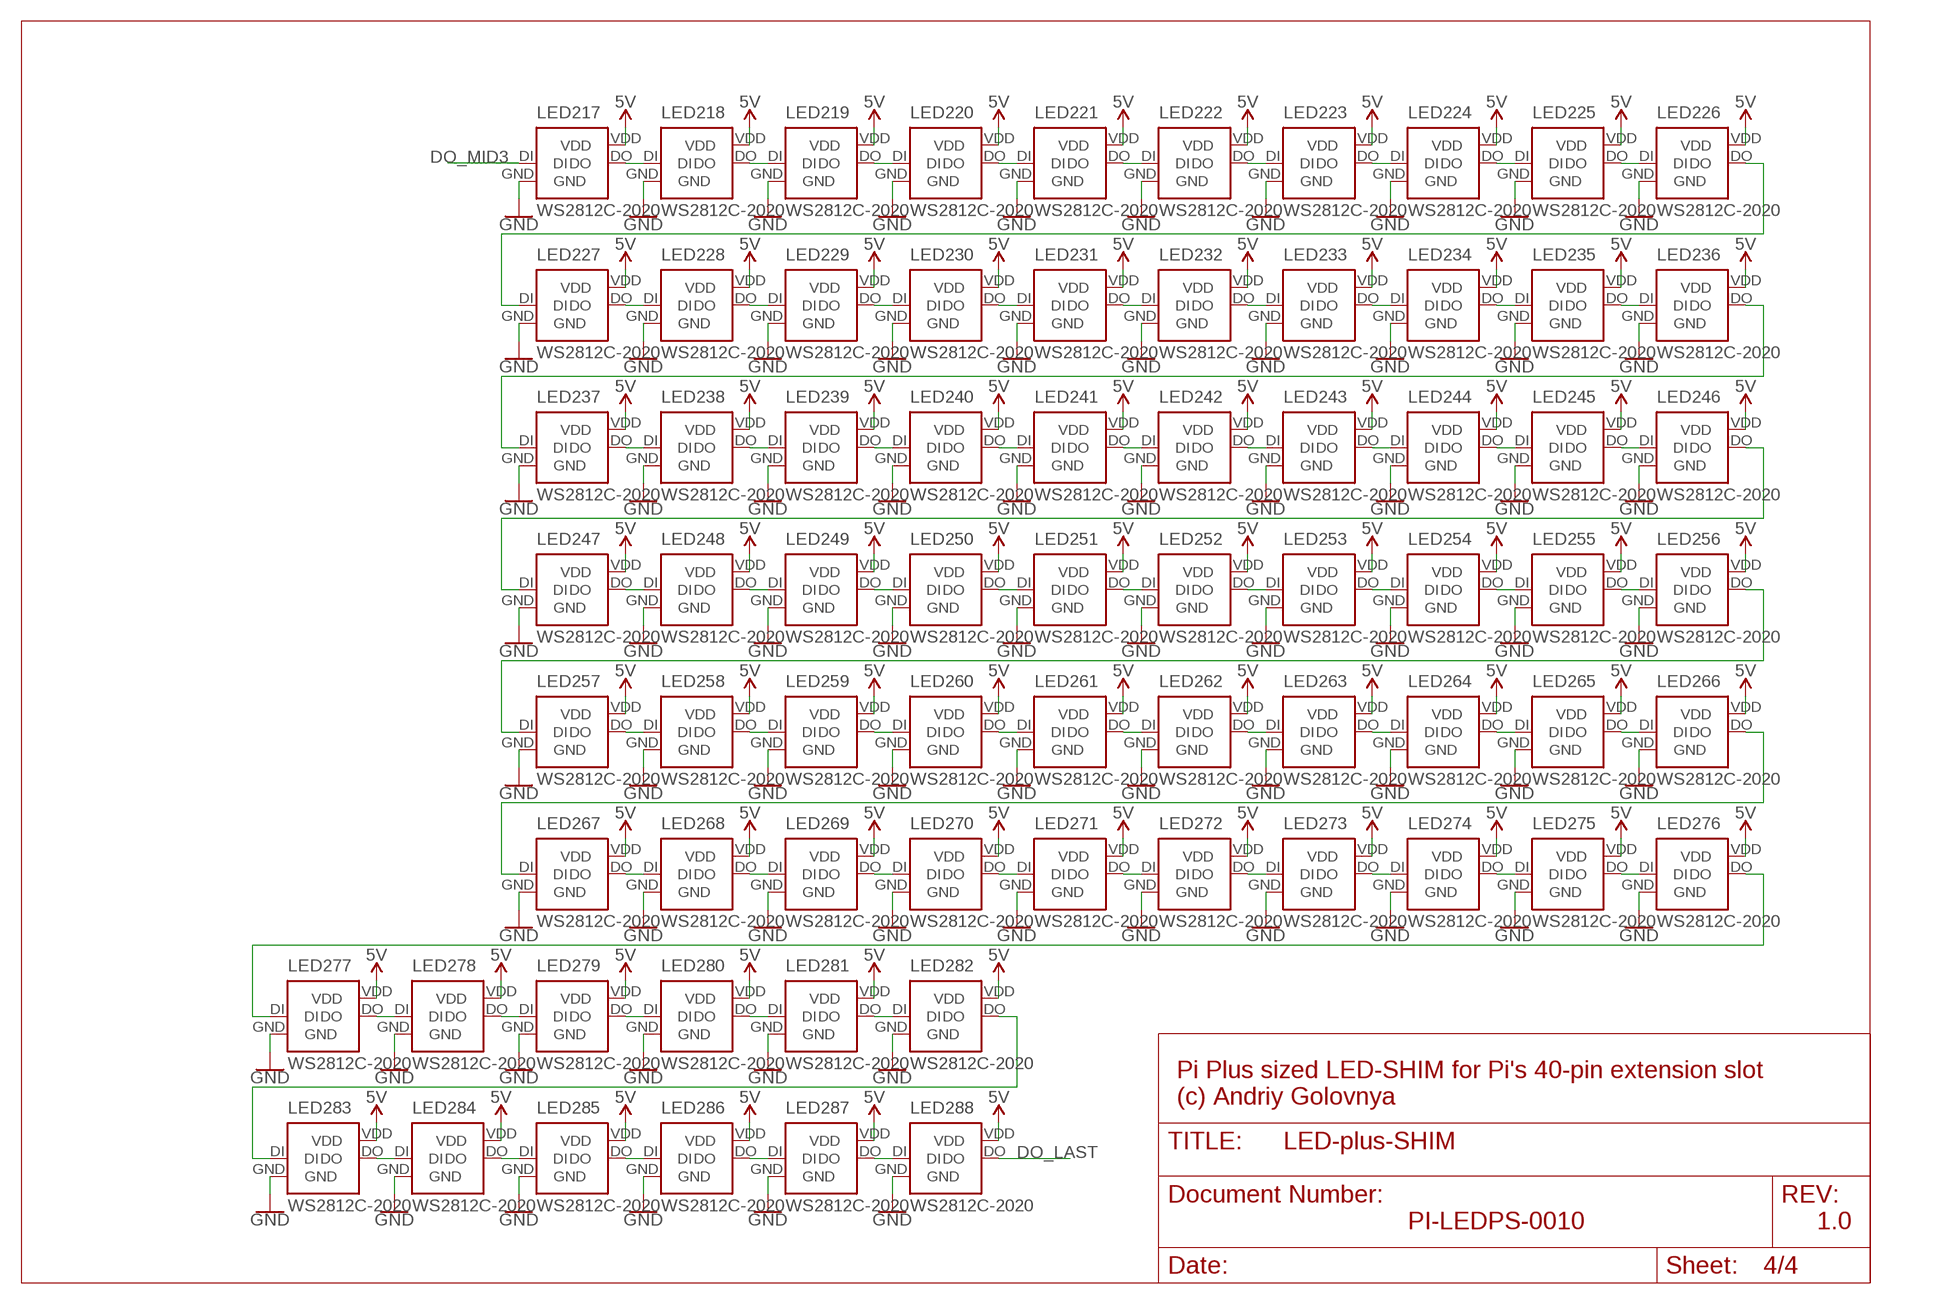
[diagram p3: schematic, sheet 4]

### Parts
LED217  WS2812C-2020  [WS2812X-2020]
LED218  WS2812C-2020  [WS2812X-2020]
LED219  WS2812C-2020  [WS2812X-2020]
LED220  WS2812C-2020  [WS2812X-2020]
LED221  WS2812C-2020  [WS2812X-2020]
LED222  WS2812C-2020  [WS2812X-2020]
LED223  WS2812C-2020  [WS2812X-2020]
LED224  WS2812C-2020  [WS2812X-2020]
LED225  WS2812C-2020  [WS2812X-2020]
LED226  WS2812C-2020  [WS2812X-2020]
LED227  WS2812C-2020  [WS2812X-2020]
LED228  WS2812C-2020  [WS2812X-2020]
LED229  WS2812C-2020  [WS2812X-2020]
LED230  WS2812C-2020  [WS2812X-2020]
LED231  WS2812C-2020  [WS2812X-2020]
LED232  WS2812C-2020  [WS2812X-2020]
LED233  WS2812C-2020  [WS2812X-2020]
LED234  WS2812C-2020  [WS2812X-2020]
LED235  WS2812C-2020  [WS2812X-2020]
LED236  WS2812C-2020  [WS2812X-2020]
LED237  WS2812C-2020  [WS2812X-2020]
LED238  WS2812C-2020  [WS2812X-2020]
LED239  WS2812C-2020  [WS2812X-2020]
LED240  WS2812C-2020  [WS2812X-2020]
LED241  WS2812C-2020  [WS2812X-2020]
LED242  WS2812C-2020  [WS2812X-2020]
LED243  WS2812C-2020  [WS2812X-2020]
LED244  WS2812C-2020  [WS2812X-2020]
LED245  WS2812C-2020  [WS2812X-2020]
LED246  WS2812C-2020  [WS2812X-2020]
LED247  WS2812C-2020  [WS2812X-2020]
LED248  WS2812C-2020  [WS2812X-2020]
LED249  WS2812C-2020  [WS2812X-2020]
LED250  WS2812C-2020  [WS2812X-2020]
LED251  WS2812C-2020  [WS2812X-2020]
LED252  WS2812C-2020  [WS2812X-2020]
LED253  WS2812C-2020  [WS2812X-2020]
LED254  WS2812C-2020  [WS2812X-2020]
LED255  WS2812C-2020  [WS2812X-2020]
LED256  WS2812C-2020  [WS2812X-2020]
LED257  WS2812C-2020  [WS2812X-2020]
LED258  WS2812C-2020  [WS2812X-2020]
LED259  WS2812C-2020  [WS2812X-2020]
LED260  WS2812C-2020  [WS2812X-2020]
LED261  WS2812C-2020  [WS2812X-2020]
LED262  WS2812C-2020  [WS2812X-2020]
LED263  WS2812C-2020  [WS2812X-2020]
LED264  WS2812C-2020  [WS2812X-2020]
LED265  WS2812C-2020  [WS2812X-2020]
LED266  WS2812C-2020  [WS2812X-2020]
LED267  WS2812C-2020  [WS2812X-2020]
LED268  WS2812C-2020  [WS2812X-2020]
LED269  WS2812C-2020  [WS2812X-2020]
LED270  WS2812C-2020  [WS2812X-2020]
LED271  WS2812C-2020  [WS2812X-2020]
LED272  WS2812C-2020  [WS2812X-2020]
LED273  WS2812C-2020  [WS2812X-2020]
LED274  WS2812C-2020  [WS2812X-2020]
LED275  WS2812C-2020  [WS2812X-2020]
LED276  WS2812C-2020  [WS2812X-2020]
LED277  WS2812C-2020  [WS2812X-2020]
LED278  WS2812C-2020  [WS2812X-2020]
LED279  WS2812C-2020  [WS2812X-2020]
LED280  WS2812C-2020  [WS2812X-2020]
LED281  WS2812C-2020  [WS2812X-2020]
LED282  WS2812C-2020  [WS2812X-2020]
LED283  WS2812C-2020  [WS2812X-2020]
LED284  WS2812C-2020  [WS2812X-2020]
LED285  WS2812C-2020  [WS2812X-2020]
LED286  WS2812C-2020  [WS2812X-2020]
LED287  WS2812C-2020  [WS2812X-2020]
LED288  WS2812C-2020  [WS2812X-2020]

### Nets
5V: LED217.VDD LED218.VDD LED219.VDD LED220.VDD LED221.VDD LED222.VDD LED223.VDD LED224.VDD LED225.VDD LED226.VDD LED227.VDD LED228.VDD LED229.VDD LED230.VDD LED231.VDD LED232.VDD LED233.VDD LED234.VDD LED235.VDD LED236.VDD LED237.VDD LED238.VDD LED239.VDD LED240.VDD LED241.VDD LED242.VDD LED243.VDD LED244.VDD LED245.VDD LED246.VDD LED247.VDD LED248.VDD LED249.VDD LED250.VDD LED251.VDD LED252.VDD LED253.VDD LED254.VDD LED255.VDD LED256.VDD LED257.VDD LED258.VDD LED259.VDD LED260.VDD LED261.VDD LED262.VDD LED263.VDD LED264.VDD LED265.VDD LED266.VDD LED267.VDD LED268.VDD LED269.VDD LED270.VDD LED271.VDD LED272.VDD LED273.VDD LED274.VDD LED275.VDD LED276.VDD LED277.VDD LED278.VDD LED279.VDD LED280.VDD LED281.VDD LED282.VDD LED283.VDD LED284.VDD LED285.VDD LED286.VDD LED287.VDD LED288.VDD ; also sheet 1,2,3
DO_LAST: LED288.DO ; also sheet 2
DO_MID3: LED217.DI ; also sheet 3
GND: LED217.GND LED218.GND LED219.GND LED220.GND LED221.GND LED222.GND LED223.GND LED224.GND LED225.GND LED226.GND LED227.GND LED228.GND LED229.GND LED230.GND LED231.GND LED232.GND LED233.GND LED234.GND LED235.GND LED236.GND LED237.GND LED238.GND LED239.GND LED240.GND LED241.GND LED242.GND LED243.GND LED244.GND LED245.GND LED246.GND LED247.GND LED248.GND LED249.GND LED250.GND LED251.GND LED252.GND LED253.GND LED254.GND LED255.GND LED256.GND LED257.GND LED258.GND LED259.GND LED260.GND LED261.GND LED262.GND LED263.GND LED264.GND LED265.GND LED266.GND LED267.GND LED268.GND LED269.GND LED270.GND LED271.GND LED272.GND LED273.GND LED274.GND LED275.GND LED276.GND LED277.GND LED278.GND LED279.GND LED280.GND LED281.GND LED282.GND LED283.GND LED284.GND LED285.GND LED286.GND LED287.GND LED288.GND ; also sheet 1,2,3
N$215: LED217.DO LED218.DI
N$216: LED218.DO LED219.DI
N$217: LED219.DO LED220.DI
N$218: LED220.DO LED221.DI
N$219: LED221.DO LED222.DI
N$220: LED222.DO LED223.DI
N$221: LED223.DO LED224.DI
N$222: LED224.DO LED225.DI
N$223: LED225.DO LED226.DI
N$224: LED226.DO LED227.DI
N$225: LED227.DO LED228.DI
N$226: LED228.DO LED229.DI
N$227: LED229.DO LED230.DI
N$228: LED230.DO LED231.DI
N$229: LED231.DO LED232.DI
N$230: LED232.DO LED233.DI
N$231: LED233.DO LED234.DI
N$232: LED234.DO LED235.DI
N$233: LED235.DO LED236.DI
N$234: LED236.DO LED237.DI
N$235: LED237.DO LED238.DI
N$236: LED238.DO LED239.DI
N$237: LED239.DO LED240.DI
N$238: LED240.DO LED241.DI
N$239: LED241.DO LED242.DI
N$240: LED242.DO LED243.DI
N$241: LED243.DO LED244.DI
N$242: LED244.DO LED245.DI
N$243: LED245.DO LED246.DI
N$244: LED246.DO LED247.DI
N$245: LED247.DO LED248.DI
N$246: LED248.DO LED249.DI
N$247: LED249.DO LED250.DI
N$248: LED250.DO LED251.DI
N$249: LED251.DO LED252.DI
N$250: LED252.DO LED253.DI
N$251: LED253.DO LED254.DI
N$252: LED254.DO LED255.DI
N$253: LED255.DO LED256.DI
N$254: LED256.DO LED257.DI
N$255: LED257.DO LED258.DI
N$256: LED258.DO LED259.DI
N$257: LED259.DO LED260.DI
N$258: LED260.DO LED261.DI
N$259: LED261.DO LED262.DI
N$260: LED262.DO LED263.DI
N$261: LED263.DO LED264.DI
N$262: LED264.DO LED265.DI
N$263: LED265.DO LED266.DI
N$264: LED266.DO LED267.DI
N$265: LED267.DO LED268.DI
N$266: LED268.DO LED269.DI
N$267: LED269.DO LED270.DI
N$268: LED270.DO LED271.DI
N$269: LED271.DO LED272.DI
N$270: LED272.DO LED273.DI
N$271: LED273.DO LED274.DI
N$272: LED274.DO LED275.DI
N$273: LED275.DO LED276.DI
N$274: LED276.DO LED277.DI
N$275: LED277.DO LED278.DI
N$276: LED278.DO LED279.DI
N$277: LED279.DO LED280.DI
N$278: LED280.DO LED281.DI
N$279: LED281.DO LED282.DI
N$280: LED282.DO LED283.DI
N$281: LED283.DO LED284.DI
N$282: LED284.DO LED285.DI
N$283: LED285.DO LED286.DI
N$284: LED286.DO LED287.DI
N$285: LED287.DO LED288.DI

### Notes on the sheet
- Pi Plus sized LED-SHIM for Pi's 40-pin extension slot
  (c) Andriy Golovnya
- PI-LEDPS-0010 | 1.0

## Library data of the parts
C1-C8 = rcl:C-EU: CAPACITOR, European symbol; SPICEPREFIX: C
IC1 = TXB0101DCKR:TXB0101DCKR
J1 J2 = SparkFun-Connectors:CONN_03: Multi connection point. Often used as Generic Header-pin footprint for 0.1 inch spaced/style header connections On any of the 0.1 inch spaced packages, you can populate with these: Break Away Headers - Straight <https://www.sparkfun.com/products/116> (PRT-00116) Break Away Male Headers - Right Angle <https://www.sparkfun.com/products/553> (PRT-00553) Female Headers <https://www.sparkfun.com/products/115> (PRT-00115) Break Away Headers - Machine Pin <https://www.sparkfun.com/products/117> (PRT-00117) Break Away Female Headers - Swiss Machine Pin <https://www.sparkfun.com/products/743> (PRT-00743) Stackable Header - 3 Pin (Female, 0.1") <https://www.sparkfun.com/products/13875> (PRT-13875) For SCREWTERMINALS and SPRING TERMINALS visit here: Screw Terimnals on SparkFun.com <https://www.sparkfun.com/search/results?term=Screw+Terminals> (5mm/3.5mm/2.54mm spacing) This device is also useful as a general connection point to wire up your design to another part of your project. Our various solder wires solder well into these plated through hole pads. Hook-Up Wire - Assortment (Stranded, 22 AWG) <https://www.sparkfun.com/products/11375> (PRT-11375) Hook-Up Wire - Assortment (Solid Core, 22 AWG) <https://www.sparkfun.com/products/11367> (PRT-11367) View the entire wire category on our website here <https://www.sparkfun.com/categories/141> Special notes: Molex polarized connector foot print use with SKU : PRT-08232 with associated crimp pins and housings.
J5 J6 = _my_locked_connectors:CONN_20: Multi connection point. Often used as Generic Header-pin footprint for 0.1 inch spaced/style header connections On any of the 0.1 inch spaced packages, you can populate with these: Break Away Headers - Straight <https://www.sparkfun.com/products/116> (PRT-00116) Break Away Male Headers - Right Angle <https://www.sparkfun.com/products/553> (PRT-00553) Female Headers <https://www.sparkfun.com/products/115> (PRT-00115) Break Away Headers - Machine Pin <https://www.sparkfun.com/products/117> (PRT-00117) Break Away Female Headers - Swiss Machine Pin <https://www.sparkfun.com/products/743> (PRT-00743) For SCREWTERMINALS and SPRING TERMINALS visit here: Screw Terimnals on SparkFun.com <https://www.sparkfun.com/search/results?term=Screw+Terminals> (5mm/3.5mm/2.54mm spacing) This device is also useful as a general connection point to wire up your design to another part of your project. Our various solder wires solder well into these plated through hole pads. Hook-Up Wire - Assortment (Stranded, 22 AWG) <https://www.sparkfun.com/products/11375> (PRT-11375) Hook-Up Wire - Assortment (Solid Core, 22 AWG) <https://www.sparkfun.com/products/11367> (PRT-11367) View the entire wire category on our website here <https://www.sparkfun.com/categories/141> Special notes: Molex polarized connector foot print use with SKU : PRT-08231 with associated crimp pins and housings. 1MM SMD Version SKU: PRT-10208 NOTES ON THE VARIANTS LOCK and LOCK_LONGPADS... This footprint was designed to help hold the alignment of a through-hole component (i.e. 6-pin header) while soldering it into place. You may notice that each hole has been shifted either up or down by 0.005 of an inch from it's more standard position (which is a perfectly straight line). This slight alteration caused the pins (the squares in the middle) to touch the edges of the holes. Because they are alternating, it causes a "brace" to hold the component in place. 0.005 has proven to be the perfect amount of "off-center" position when using our standard breakaway headers. Although looks a little odd when you look at the bare footprint, once you have a header in there, the alteration is very hard to notice. Also,if you push a header all the way into place, it is covered up entirely on the bottom side. Note about LOCK SPECIAL package: This is just like the LOCK variant in that the holes are staggared by 5 mil, but except for the last two holes. They are not altered from the "standard" footprint layout. This is used for a special purpose on the layout of our Graphic LCD Backpack. Make sure you want to use this device before selecting it for you project!
LED1-LED288 = WS281X:WS2812: WS2812 RGB LED
LOGO1 = _my_logos:MFDECLOGO: Midnight Fog - Digital Eye Candy LOGO
R1 = rcl:R-EU_: RESISTOR, European symbol; SPICEPREFIX: R
SJ1 = _my_jumpers:SJ3: SMD solder JUMPER SJ3 - simple jumper SJ3FI - fancy inside jumper SJ3FO - fancy outside jumper SJ3W - wide jumper